# Altium schematic sheet SCH_A3_TempClassic.SchDoc
size A3
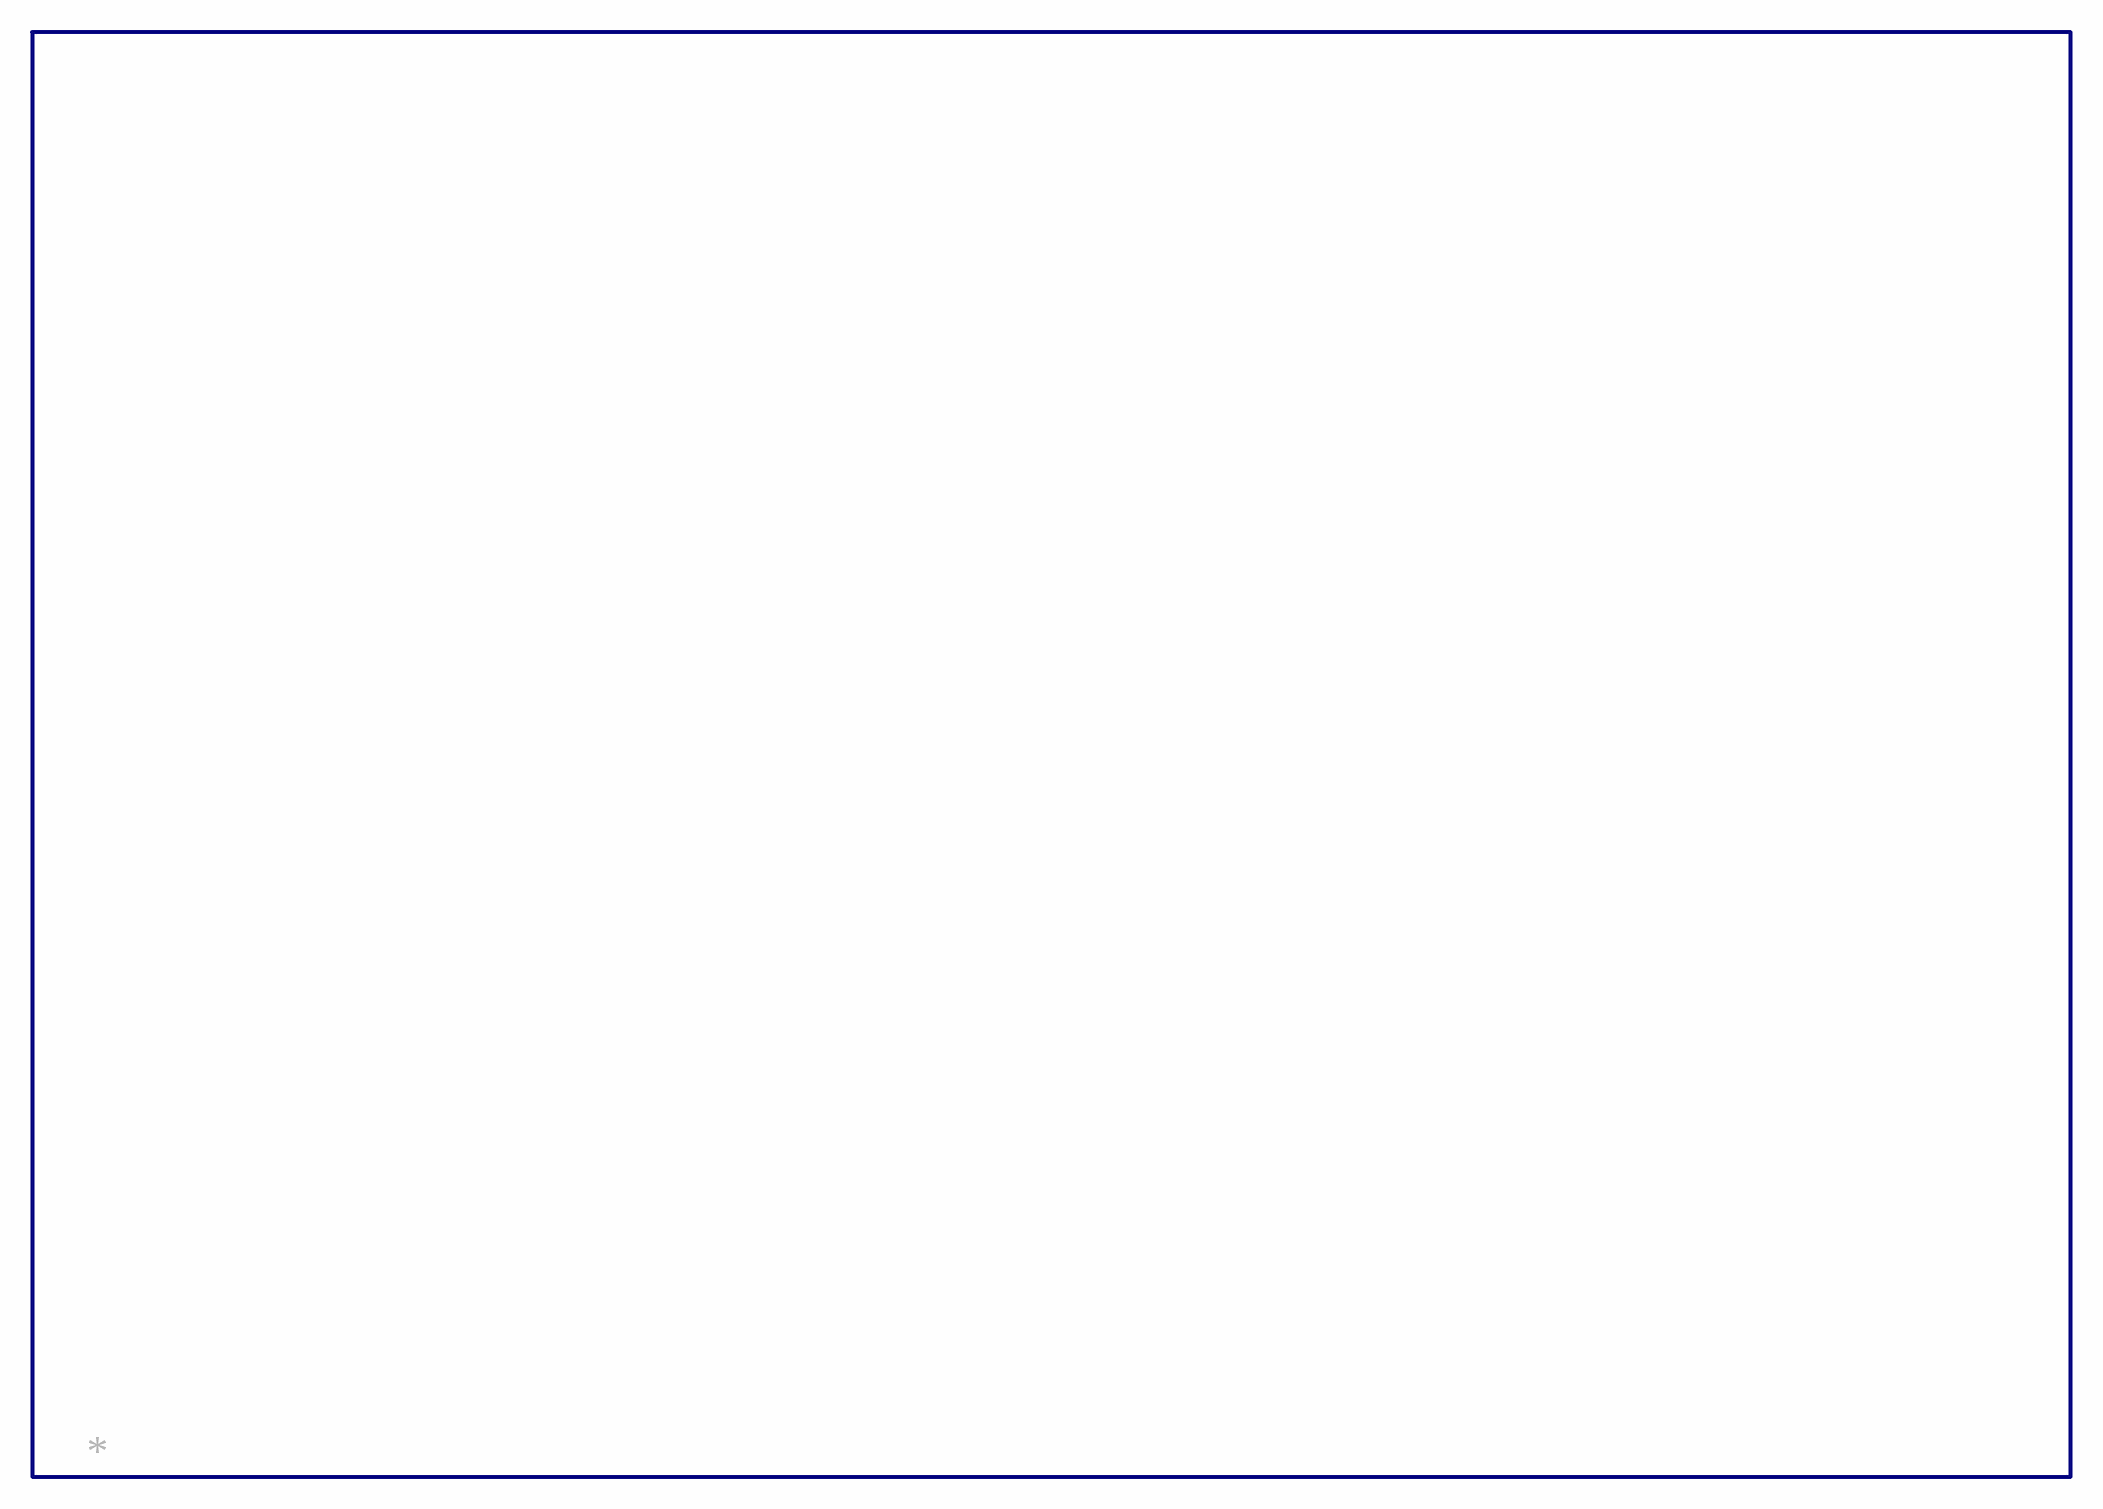
[diagram p0: SCH_A3_TempClassic.SchDoc]